# EAGLE design MINI2440-Distributor-1 (EAGLE 5.06)
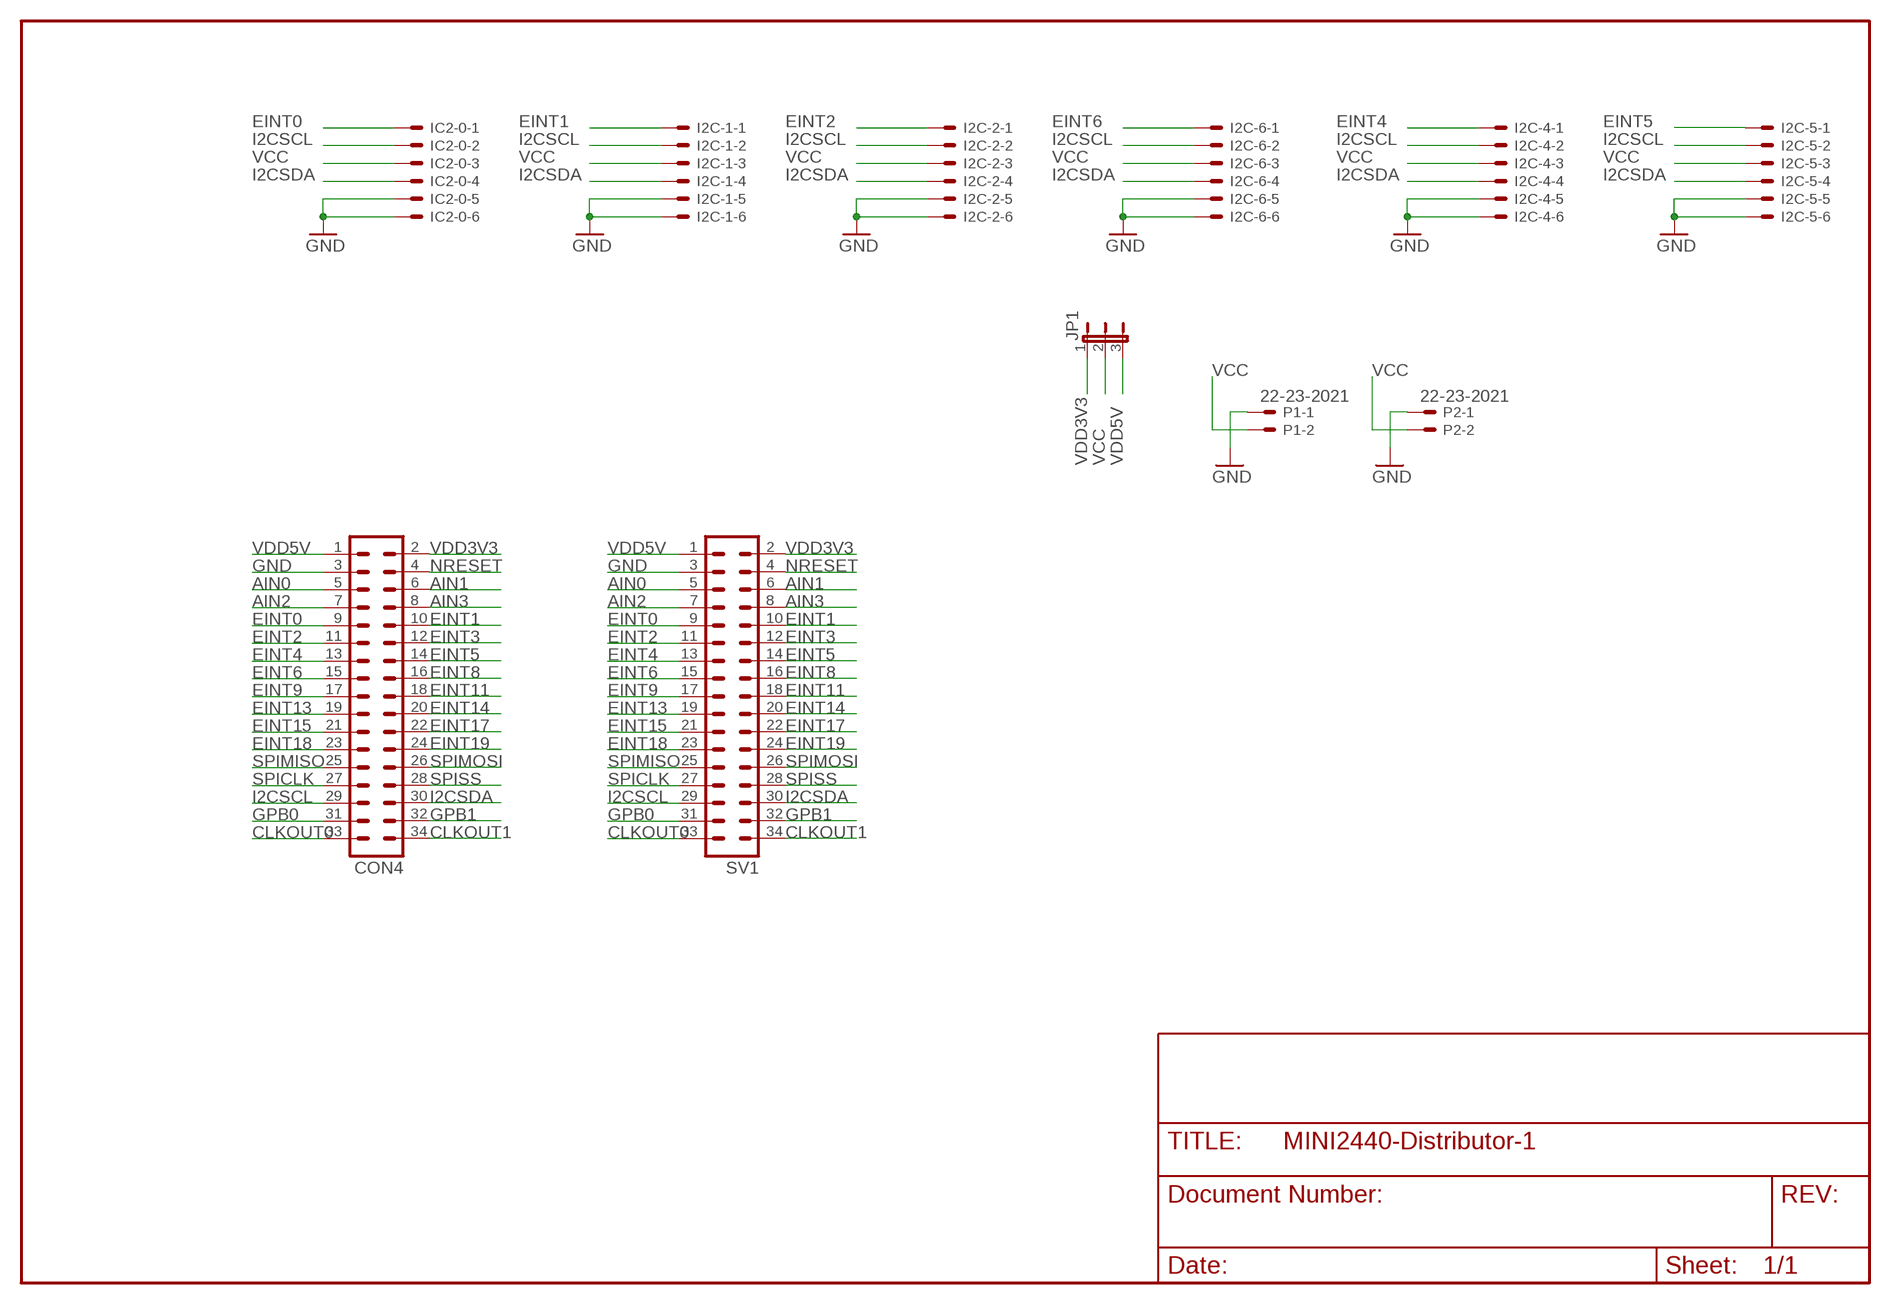
[diagram p0: schematic, sheet 1]

## Parts
CON4  ML34  [ML34]
I2C-1  22-23-2061  [22-23-2061]
I2C-2  22-23-2061  [22-23-2061]
I2C-4  22-23-2061  [22-23-2061]
I2C-5  22-23-2061  [22-23-2061]
I2C-6  22-23-2061  [22-23-2061]
IC2-0  22-23-2061  [22-23-2061]
JP1  JP2E  [JP2]
P1  22-23-2021  [22-23-2021]
P2  22-23-2021  [22-23-2021]
SV1  ML34  [ML34]

## Nets
AIN0: CON4.5 SV1.5
AIN1: CON4.6 SV1.6
AIN2: CON4.7 SV1.7
AIN3: CON4.8 SV1.8
CLKOUT0: CON4.33 SV1.33
CLKOUT1: CON4.34 SV1.34
EINT0: CON4.9 IC2-0.1 SV1.9
EINT1: CON4.10 I2C-1.1 SV1.10
EINT2: CON4.11 I2C-2.1 SV1.11
EINT3: CON4.12 SV1.12
EINT4: CON4.13 I2C-4.1 SV1.13
EINT5: CON4.14 I2C-5.1 SV1.14
EINT6: CON4.15 I2C-6.1 SV1.15
EINT8: CON4.16 SV1.16
EINT9: CON4.17 SV1.17
EINT11: CON4.18 SV1.18
EINT13: CON4.19 SV1.19
EINT14: CON4.20 SV1.20
EINT15: CON4.21 SV1.21
EINT17: CON4.22 SV1.22
EINT18: CON4.23 SV1.23
EINT19: CON4.24 SV1.24
GND: CON4.3 I2C-1.5 I2C-1.6 I2C-2.5 I2C-2.6 I2C-4.5 I2C-4.6 I2C-5.5 I2C-5.6 I2C-6.5 I2C-6.6 IC2-0.5 IC2-0.6 P1.1 P2.1 SV1.3
GPB0: CON4.31 SV1.31
GPB1: CON4.32 SV1.32
I2CSCL: CON4.29 I2C-1.2 I2C-2.2 I2C-4.2 I2C-5.2 I2C-6.2 IC2-0.2 SV1.29
I2CSDA: CON4.30 I2C-1.4 I2C-2.4 I2C-4.4 I2C-5.4 I2C-6.4 IC2-0.4 SV1.30
NRESET: CON4.4 SV1.4
SPICLK: CON4.27 SV1.27
SPIMISO: CON4.25 SV1.25
SPIMOSI: CON4.26 SV1.26
SPISS: CON4.28 SV1.28
VCC: I2C-1.3 I2C-2.3 I2C-4.3 I2C-5.3 I2C-6.3 IC2-0.3 JP1.2 P1.2 P2.2
VDD3V3: CON4.2 JP1.1 SV1.2
VDD5V: CON4.1 JP1.3 SV1.1

## Library data of the parts
CON4 SV1 = con-harting-ml:ML34: HARTING
I2C-1 I2C-2 I2C-4-I2C-6 IC2-0 = con-molex:22-23-2061: .100" (2.54mm) Center Header - 6 Pin
JP1 = jumper:JP2E: JUMPER
P1 P2 = con-molex:22-23-2021: .100" (2.54mm) Center Header - 2 Pin

## Board
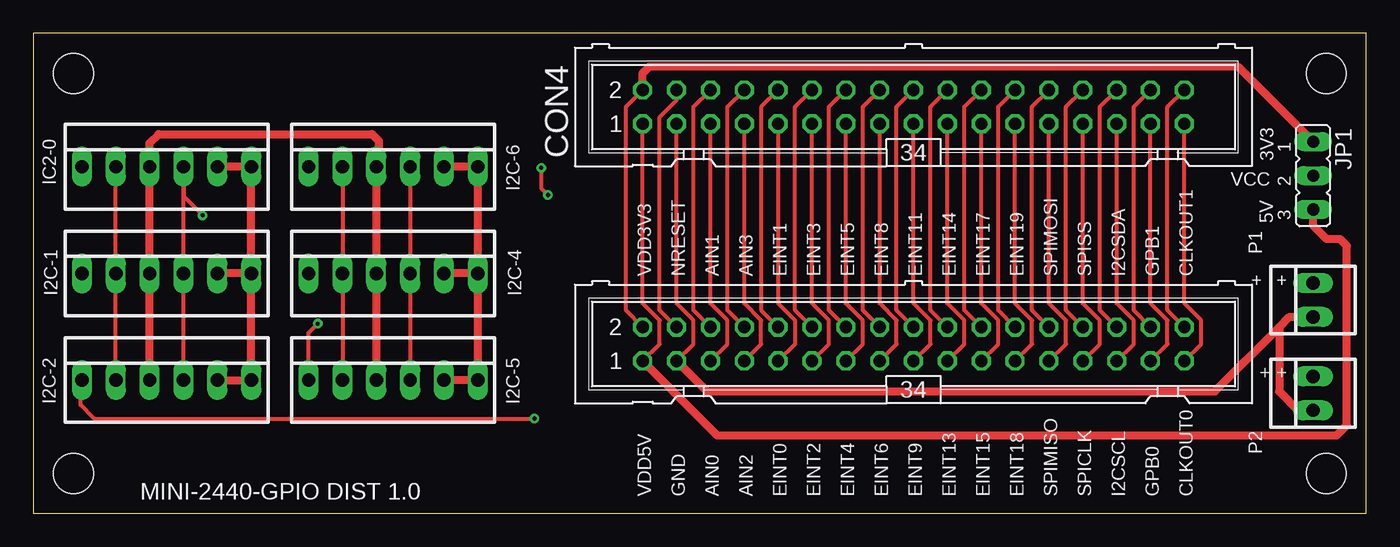
[diagram p1: board, top side]
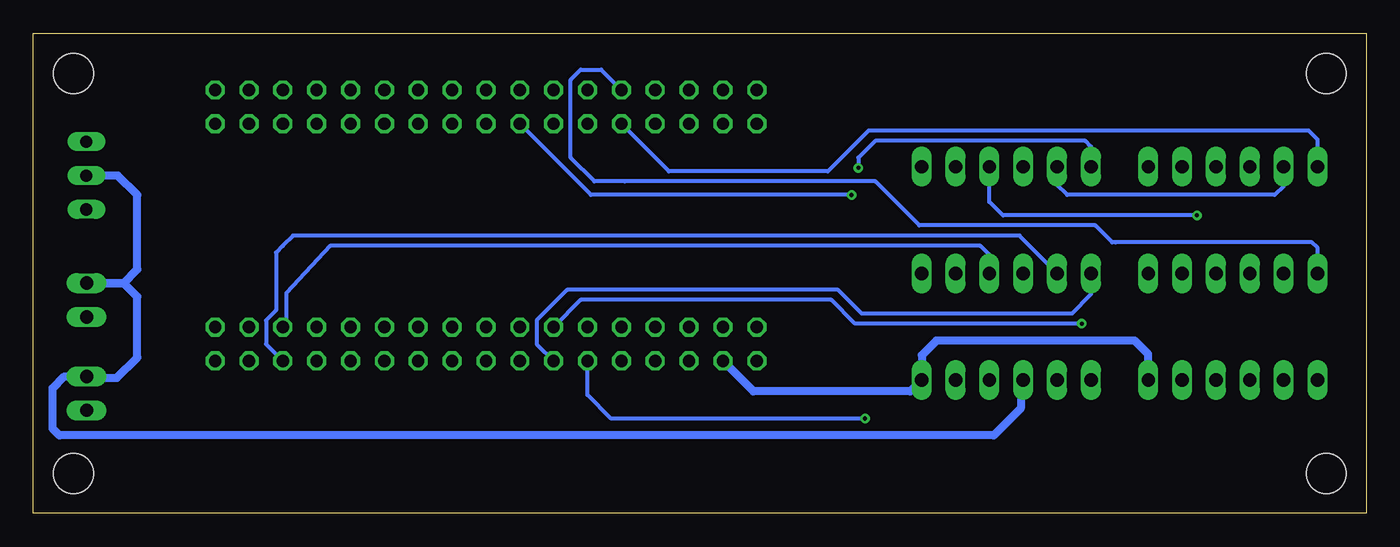
[diagram p2: board, bottom side, seen from below]

Size 100 x 36 mm. Coordinates in mm from the lower left corner, seen from the top.
Outline: 0,0 100,0 100,36 0,36 0,0
Copper layers (1*16): Top 0.035mm / dielectric 1.5mm / Bottom 0.035mm
Design rules "default": minimum track width 10mil, minimum drill 24mil, track to track 8mil, track to pad 8mil, pad to pad 8mil, via to via 8mil, smd to smd 8mil, copper to edge 40mil, drill to drill 8mil, minimum pad ring 10mil, minimum via ring 8mil, stop-mask expansion 4mil, vias tented up to drill 0mil, thermal gap 10mil
Holes 3 mm at 3,33 3,3 97,33 97,3

### Footprints (pad centres in the part's own frame; a part is rotated, then mirrored left to right if it is on the bottom)
ML34 = drill 0.914 octagon: 1 -20.32,-1.27; 2 -20.32,1.27; 3 -17.78,-1.27; 4 -17.78,1.27; 5 -15.24,-1.27; 6 -15.24,1.27; 7 -12.7,-1.27; 8 -12.7,1.27; 9 -10.16,-1.27; 10 -10.16,1.27; 11 -7.62,-1.27; 12 -7.62,1.27; 13 -5.08,-1.27; 14 -5.08,1.27; 15 -2.54,-1.27; 16 -2.54,1.27; 17 0,-1.27; 18 0,1.27; 19 2.54,-1.27; 20 2.54,1.27; 21 5.08,-1.27; 22 5.08,1.27; 23 7.62,-1.27; 24 7.62,1.27; 25 10.16,-1.27; 26 10.16,1.27; 27 12.7,-1.27; 28 12.7,1.27; 29 15.24,-1.27; 30 15.24,1.27; 31 17.78,-1.27; 32 17.78,1.27; 33 20.32,-1.27; 34 20.32,1.27
22-23-2061 = drill 1 long: 1 -6.35,0; 2 -3.81,0; 3 -1.27,0; 4 1.27,0; 5 3.81,0; 6 6.35,0
JP2 = drill 0.914 long: 1 -2.54,0; 2 0,0; 3 2.54,0
22-23-2021 = drill 1 long: 1 -1.27,0; 2 1.27,0

### Placement (x,y rotation side)
CON4  66.04,30.48 0 top
I2C-1  10,18 0 top
I2C-2  10,10 0 top
I2C-4  27,18 0 top
I2C-5  27,10 0 top
I2C-6  27,26 0 top
IC2-0  10,26 0 top
JP1  96.02,25.33 270 top
P1  96,16 90 top
P2  96,9 90 top
SV1  66.04,12.7 0 top

### Tracks (layer width: path | path; a pad name or v marks a point on that pad's centre or on a via)
AIN0
  Top 0.305: CON4.5 50.8,15.75 52.07,14.48 52.07,12.7 SV1.5
AIN1
  Top 0.305: CON4.6 49.53,30.48 49.53,15.24 SV1.6
AIN2
  Top 0.305: CON4.7 53.34,15.75 54.61,14.48 54.61,12.7 SV1.7
AIN3
  Top 0.305: CON4.8 52.07,30.48 52.07,15.24 SV1.8
CLKOUT0
  Top 0.305: CON4.33 86.36,15.75 87.63,14.48 87.63,12.7 SV1.33
CLKOUT1
  Top 0.305: CON4.34 85.09,30.48 85.09,15.24 SV1.34
EINT0
  Top 0.305: CON4.9 55.88,15.75 57.15,14.48 57.15,12.7 SV1.9
  Bottom 0.305: IC2-0.1 3.65,28.03 4.32,28.7 37.34,28.7 40.39,25.65 52.32,25.65 CON4.9
EINT1
  Top 0.305: CON4.10 54.61,30.48 54.61,15.24 SV1.10
  Bottom 0.305: I2C-1.1 3.65,19.91 4.06,20.32 18.8,20.32 19.05,20.32 20.32,21.59 33.53,21.59 36.83,24.89 55.63,24.89 57.91,24.89 59.69,26.67 59.69,32.51 58.93,33.27 57.4,33.27 CON4.10
EINT2  (via drill 0.3)
  Top 0.305: CON4.11 58.42,15.75 59.69,14.48 59.69,12.7 SV1.11 | v37.59,7.11 4.57,7.11 3.56,8.13 3.56,9.91 I2C-2.1
  Bottom 0.305: SV1.11 58.42,8.89 56.64,7.11 v37.59,7.11
EINT3
  Top 0.305: CON4.12 57.15,30.48 57.15,15.24 SV1.12
EINT4
  Top 0.305: CON4.13 60.96,15.75 62.23,14.48 62.23,12.7 SV1.13
  Bottom 0.305: I2C-4.1 20.65,16.43 22.1,14.99 37.85,14.99 39.62,16.76 59.94,16.76 62.23,14.48 62.23,12.7 SV1.13
EINT5  (via drill 0.3)
  Top 0.305: CON4.14 60.96,31.5 60.71,31.5 59.69,30.48 59.69,15.24 SV1.14 | I2C-5.1 20.65,13.54 v21.34,14.22
  Bottom 0.305: v21.34,14.22 38.35,14.22 40.13,16 58.93,16 SV1.14
EINT6  (via drill 0.3)
  Top 0.305: CON4.15 63.5,15.75 64.77,14.48 64.77,12.7 SV1.15 | v38.1,25.91 38.1,24.38 v38.61,23.88
  Bottom 0.305: I2C-6.1 20.65,27.51 21.08,27.94 36.83,27.94 38.1,26.67 v38.1,25.91 | v38.61,23.88 58.17,23.88 CON4.15
EINT8
  Top 0.305: CON4.16 63.5,31.24 62.99,31.24 62.23,30.48 62.23,15.24 SV1.16
EINT9
  Top 0.305: CON4.17 66.04,15.75 67.31,14.48 67.31,12.7 SV1.17
EINT11
  Top 0.305: SV1.18 64.77,15.24 64.77,30.48 65.79,31.5 66.04,31.5 CON4.18
EINT13
  Top 0.305: CON4.19 68.58,15.75 69.85,14.48 69.85,12.7 SV1.19
EINT14
  Top 0.305: CON4.20 68.58,31.5 68.33,31.5 67.31,30.48 67.31,15.24 SV1.20
EINT15
  Top 0.305: CON4.21 71.12,15.75 72.39,14.48 72.39,12.7 SV1.21
EINT17
  Top 0.305: CON4.22 69.85,30.48 69.85,15.24 SV1.22
EINT18
  Top 0.305: CON4.23 73.66,15.75 74.93,14.48 74.93,12.7 SV1.23
EINT19
  Top 0.305: CON4.24 72.39,30.48 72.39,15.24 SV1.24
GND
  Top 0.305: CON4.3 48.26,15.75 49.53,14.48 49.53,12.7 SV1.3
  Top 0.61: P2.1 94.89,7.73 93.47,9.14 93.47,13.97 | 93.47,13.97 94.23,14.73 P1.1 | I2C-1.6 IC2-0.6 IC2-0.5 | I2C-1.6 I2C-2.6 I2C-2.5 | I2C-4.6 I2C-6.6 I2C-6.5 | I2C-4.6 I2C-5.6 I2C-5.5 | I2C-1.6 I2C-1.5 | I2C-4.6 I2C-4.5 | 93.47,13.97 88.65,9.14 50.55,9.14 SV1.3
  Bottom 0.61: I2C-2.6 16.35,11.94 17.37,12.95 32.26,12.95 33.35,11.86 I2C-5.6 34.21,9.14 45.97,9.14 SV1.3
GPB0
  Top 0.305: CON4.31 83.82,15.75 85.09,14.48 85.09,12.7 SV1.31
GPB1
  Top 0.305: CON4.32 82.55,30.48 82.55,15.24 SV1.32
I2CSCL
  Top 0.305: CON4.29 81.28,15.75 82.55,14.48 82.55,12.7 SV1.29 | IC2-0.2 I2C-1.2 I2C-2.2 | I2C-6.2 I2C-4.2 I2C-5.2
  Bottom 0.305: I2C-4.2 26.02,20.83 77.98,20.83 80.52,20.83 81.28,20.07 81.79,19.56 81.79,15.24 82.55,14.48 82.55,12.7 SV1.29 | IC2-0.2 6.19,24.54 6.86,23.88 22.43,23.88 23.19,24.64 I2C-6.2
I2CSDA  (via drill 0.3)
  Top 0.305: CON4.30 80.01,30.48 80.01,15.24 SV1.30 | I2C-6.4 I2C-4.4 I2C-5.4 | I2C-2.4 I2C-1.4 IC2-0.4 11.27,23.78 v12.7,22.35
  Bottom 0.305: I2C-4.4 28.27,19.38 28.96,20.07 77.72,20.07 81.03,16.51 81.03,14.22 SV1.30 | v12.7,22.35 27.25,22.35 28.27,23.37 28.27,25.4 I2C-6.4
NRESET
  Top 0.305: CON4.4 48.26,30.99 46.99,29.72 46.99,15.24 SV1.4
SPICLK
  Top 0.305: CON4.27 78.74,15.75 80.01,14.48 80.01,12.7 SV1.27
SPIMISO
  Top 0.305: CON4.25 76.2,15.75 77.47,14.48 77.47,12.7 SV1.25
SPIMOSI
  Top 0.305: CON4.26 74.93,30.48 74.93,15.24 SV1.26
SPISS
  Top 0.305: CON4.28 77.47,30.48 77.47,15.24 SV1.28
VCC
  Top 0.61: 25.91,9.82 I2C-5.3 I2C-4.3 I2C-6.3 25.91,26.18 25.91,27.94 25.4,28.45 9.4,28.45 8.73,27.78 IC2-0.3 I2C-1.3 I2C-2.3
  Bottom 0.61: JP1.2 93.66,25.33 92.2,23.88 92.2,18.29 93.22,17.27 P1.2 93.22,17.27 92.2,16.26 92.2,11.68 93.73,10.16 95.89,10.16 P2.2 97.68,10.27 98.55,9.4 98.55,6.35 98.04,5.84 27.94,5.84 25.91,7.87 25.91,9.82 | 25.91,9.82 I2C-5.3 25.91,9.82
VDD3V3
  Top 0.305: CON4.2 44.45,30.48 44.45,15.24 SV1.2
  Top 0.61: CON4.2 45.72,33.02 46.23,33.53 90.36,33.53 JP1.1
VDD5V
  Top 0.305: CON4.1 45.72,15.75 46.99,14.48 46.99,12.7 SV1.1
  Top 0.61: JP1.3 96.02,21.58 97.03,20.57 98.04,20.57 98.55,20.07 98.55,6.6 97.79,5.84 51.31,5.84 SV1.1

### Text on the board
tNames: 3V3 | VCC | 5V | VDD3V3 | NRESET | AIN1 | AIN3 | EINT1 | EINT3 | EINT5 | EINT8 | EINT11 | EINT14 | EINT17 | EINT19 | SPIMOSI | SPISS | I2CSDA | GPB1 | CLKOUT1 | + | + | + | + | MINI-2440-GPIO DIST 1.0 | VDD5V | GND | AIN0 | AIN2 | EINT0 | EINT2 | EINT4 | EINT6 | EINT9 | EINT13 | EINT15 | EINT18 | SPIMISO | SPICLK | I2CSCL | GPB0 | CLKOUT0